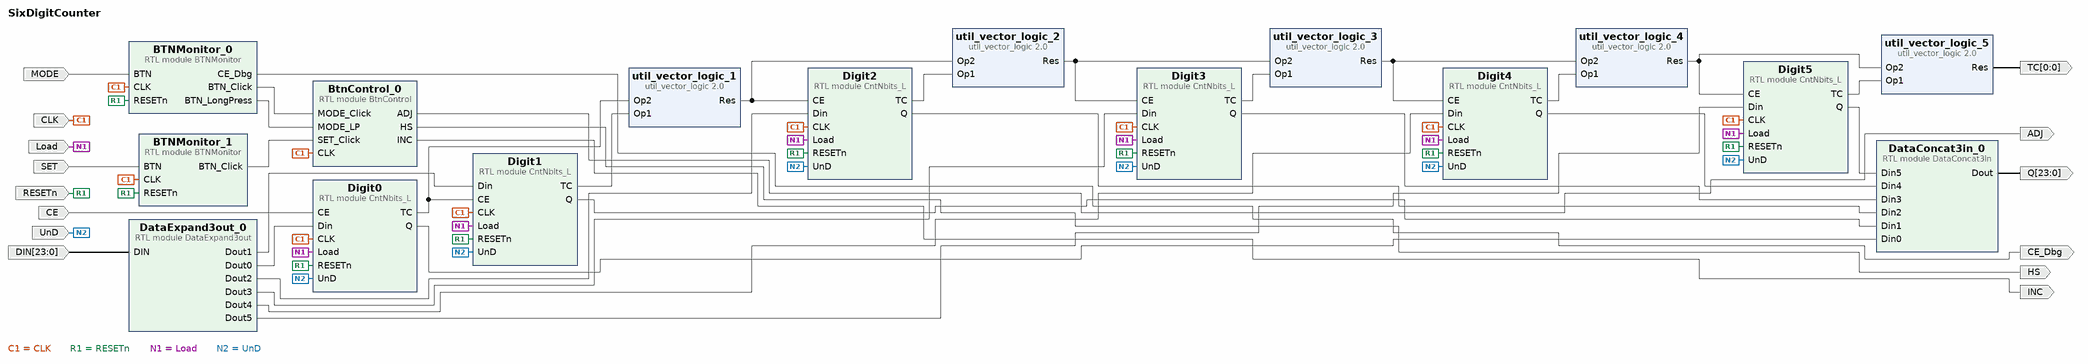
[diagram p0: block diagram of the top level]
# Vivado block design SixDigitCounter, xc7a100tcsg324-1, Vivado 2020.1
create_bd_design SixDigitCounter

create_bd_port -dir I -type clk CLK
set_property -dict {CONFIG.FREQ_HZ 100000000} [get_bd_ports CLK]
create_bd_port -dir I -type rst RESETn
create_bd_port -dir I UnD
create_bd_port -dir O -from 0 -to 0 TC
create_bd_port -dir I MODE
create_bd_port -dir I SET
create_bd_port -dir O CE_Dbg
create_bd_port -dir O -from 23 -to 0 Q
create_bd_port -dir I CE
create_bd_port -dir I -from 23 -to 0 DIN
create_bd_port -dir O ADJ
create_bd_port -dir O HS
create_bd_port -dir O INC
create_bd_port -dir I Load

create_bd_cell -type module -reference DataExpand3out DataExpand3out_0
create_bd_cell -type ip -vlnv xilinx.com:ip:util_vector_logic:2.0 util_vector_logic_1
set_property -dict {CONFIG.C_SIZE 1} [get_bd_cells util_vector_logic_1]
create_bd_cell -type ip -vlnv xilinx.com:ip:util_vector_logic:2.0 util_vector_logic_2
set_property -dict {CONFIG.C_SIZE 1} [get_bd_cells util_vector_logic_2]
create_bd_cell -type ip -vlnv xilinx.com:ip:util_vector_logic:2.0 util_vector_logic_3
set_property -dict {CONFIG.C_SIZE 1} [get_bd_cells util_vector_logic_3]
create_bd_cell -type ip -vlnv xilinx.com:ip:util_vector_logic:2.0 util_vector_logic_4
set_property -dict {CONFIG.C_SIZE 1} [get_bd_cells util_vector_logic_4]
create_bd_cell -type ip -vlnv xilinx.com:ip:util_vector_logic:2.0 util_vector_logic_5
set_property -dict {CONFIG.C_SIZE 1} [get_bd_cells util_vector_logic_5]
create_bd_cell -type module -reference DataConcat3in DataConcat3in_0
create_bd_cell -type module -reference CntNbits_L Digit0
create_bd_cell -type module -reference CntNbits_L Digit1
set_property -dict {CONFIG.LIMIT 5} [get_bd_cells Digit1]
create_bd_cell -type module -reference CntNbits_L Digit2
create_bd_cell -type module -reference CntNbits_L Digit3
set_property -dict {CONFIG.LIMIT 5} [get_bd_cells Digit3]
create_bd_cell -type module -reference CntNbits_L Digit4
create_bd_cell -type module -reference CntNbits_L Digit5
set_property -dict {CONFIG.LIMIT 2} [get_bd_cells Digit5]
create_bd_cell -type module -reference BTNMonitor BTNMonitor_0
create_bd_cell -type module -reference BTNMonitor BTNMonitor_1
create_bd_cell -type module -reference BtnControl BtnControl_0

# ---- connections ----

connect_bd_net [get_bd_ports CLK] \
  [get_bd_pins Digit0/CLK] [get_bd_pins Digit1/CLK] [get_bd_pins Digit2/CLK] [get_bd_pins Digit3/CLK] \
  [get_bd_pins Digit4/CLK] [get_bd_pins Digit5/CLK] [get_bd_pins BTNMonitor_0/CLK] [get_bd_pins BTNMonitor_1/CLK] \
  [get_bd_pins BtnControl_0/CLK]
connect_bd_net [get_bd_ports RESETn] \
  [get_bd_pins Digit0/RESETn] [get_bd_pins Digit1/RESETn] [get_bd_pins Digit2/RESETn] [get_bd_pins Digit3/RESETn] \
  [get_bd_pins Digit4/RESETn] [get_bd_pins Digit5/RESETn] [get_bd_pins BTNMonitor_0/RESETn] [get_bd_pins BTNMonitor_1/RESETn]
connect_bd_net [get_bd_ports Load] \
  [get_bd_pins Digit0/Load] [get_bd_pins Digit1/Load] [get_bd_pins Digit2/Load] [get_bd_pins Digit3/Load] \
  [get_bd_pins Digit4/Load] [get_bd_pins Digit5/Load]
connect_bd_net [get_bd_ports UnD] \
  [get_bd_pins Digit0/UnD] [get_bd_pins Digit1/UnD] [get_bd_pins Digit2/UnD] [get_bd_pins Digit3/UnD] \
  [get_bd_pins Digit4/UnD] [get_bd_pins Digit5/UnD]
connect_bd_net [get_bd_pins DataExpand3out_0/Dout0] [get_bd_pins Digit0/Din]
connect_bd_net -net util_vector_logic_0_Res [get_bd_pins Digit0/TC] [get_bd_pins util_vector_logic_1/Op2] [get_bd_pins Digit1/CE]
connect_bd_net [get_bd_pins DataExpand3out_0/Dout1] [get_bd_pins Digit1/Din]
connect_bd_net [get_bd_pins Digit1/TC] [get_bd_pins util_vector_logic_1/Op1]
connect_bd_net [get_bd_pins util_vector_logic_1/Res] [get_bd_pins util_vector_logic_2/Op2] [get_bd_pins Digit2/CE]
connect_bd_net [get_bd_pins DataExpand3out_0/Dout2] [get_bd_pins Digit2/Din]
connect_bd_net [get_bd_pins Digit2/TC] [get_bd_pins util_vector_logic_2/Op1]
connect_bd_net [get_bd_pins util_vector_logic_2/Res] [get_bd_pins util_vector_logic_3/Op2] [get_bd_pins Digit3/CE]
connect_bd_net [get_bd_pins DataExpand3out_0/Dout3] [get_bd_pins Digit3/Din]
connect_bd_net [get_bd_pins DataExpand3out_0/Dout4] [get_bd_pins Digit4/Din]
connect_bd_net [get_bd_pins Digit3/TC] [get_bd_pins util_vector_logic_3/Op1]
connect_bd_net [get_bd_pins Digit4/TC] [get_bd_pins util_vector_logic_4/Op1]
connect_bd_net [get_bd_pins util_vector_logic_3/Res] [get_bd_pins util_vector_logic_4/Op2] [get_bd_pins Digit4/CE]
connect_bd_net [get_bd_pins util_vector_logic_4/Res] [get_bd_pins util_vector_logic_5/Op2] [get_bd_pins Digit5/CE]
connect_bd_net [get_bd_pins Digit5/TC] [get_bd_pins util_vector_logic_5/Op1]
connect_bd_net [get_bd_pins util_vector_logic_5/Res] [get_bd_ports TC]
connect_bd_net [get_bd_pins DataExpand3out_0/Dout5] [get_bd_pins Digit5/Din]
connect_bd_net [get_bd_pins Digit5/Q] [get_bd_pins DataConcat3in_0/Din5]
connect_bd_net [get_bd_pins Digit4/Q] [get_bd_pins DataConcat3in_0/Din4]
connect_bd_net [get_bd_pins Digit3/Q] [get_bd_pins DataConcat3in_0/Din3]
connect_bd_net [get_bd_pins Digit2/Q] [get_bd_pins DataConcat3in_0/Din2]
connect_bd_net [get_bd_pins Digit1/Q] [get_bd_pins DataConcat3in_0/Din1]
connect_bd_net [get_bd_pins Digit0/Q] [get_bd_pins DataConcat3in_0/Din0]
connect_bd_net [get_bd_ports MODE] [get_bd_pins BTNMonitor_0/BTN]
connect_bd_net [get_bd_ports SET] [get_bd_pins BTNMonitor_1/BTN]
connect_bd_net [get_bd_pins BTNMonitor_0/CE_Dbg] [get_bd_ports CE_Dbg]
connect_bd_net [get_bd_pins BTNMonitor_0/BTN_Click] [get_bd_pins BtnControl_0/MODE_Click]
connect_bd_net [get_bd_pins BTNMonitor_0/BTN_LongPress] [get_bd_pins BtnControl_0/MODE_LP]
connect_bd_net [get_bd_pins BTNMonitor_1/BTN_Click] [get_bd_pins BtnControl_0/SET_Click]
connect_bd_net [get_bd_pins DataConcat3in_0/Dout] [get_bd_ports Q]
connect_bd_net [get_bd_ports CE] [get_bd_pins Digit0/CE]
connect_bd_net [get_bd_ports DIN] [get_bd_pins DataExpand3out_0/DIN]
connect_bd_net [get_bd_pins BtnControl_0/ADJ] [get_bd_ports ADJ]
connect_bd_net [get_bd_pins BtnControl_0/HS] [get_bd_ports HS]
connect_bd_net [get_bd_pins BtnControl_0/INC] [get_bd_ports INC]

validate_bd_design
save_bd_design
